# EAGLE design ESP-12 (EAGLE 7.3.0)
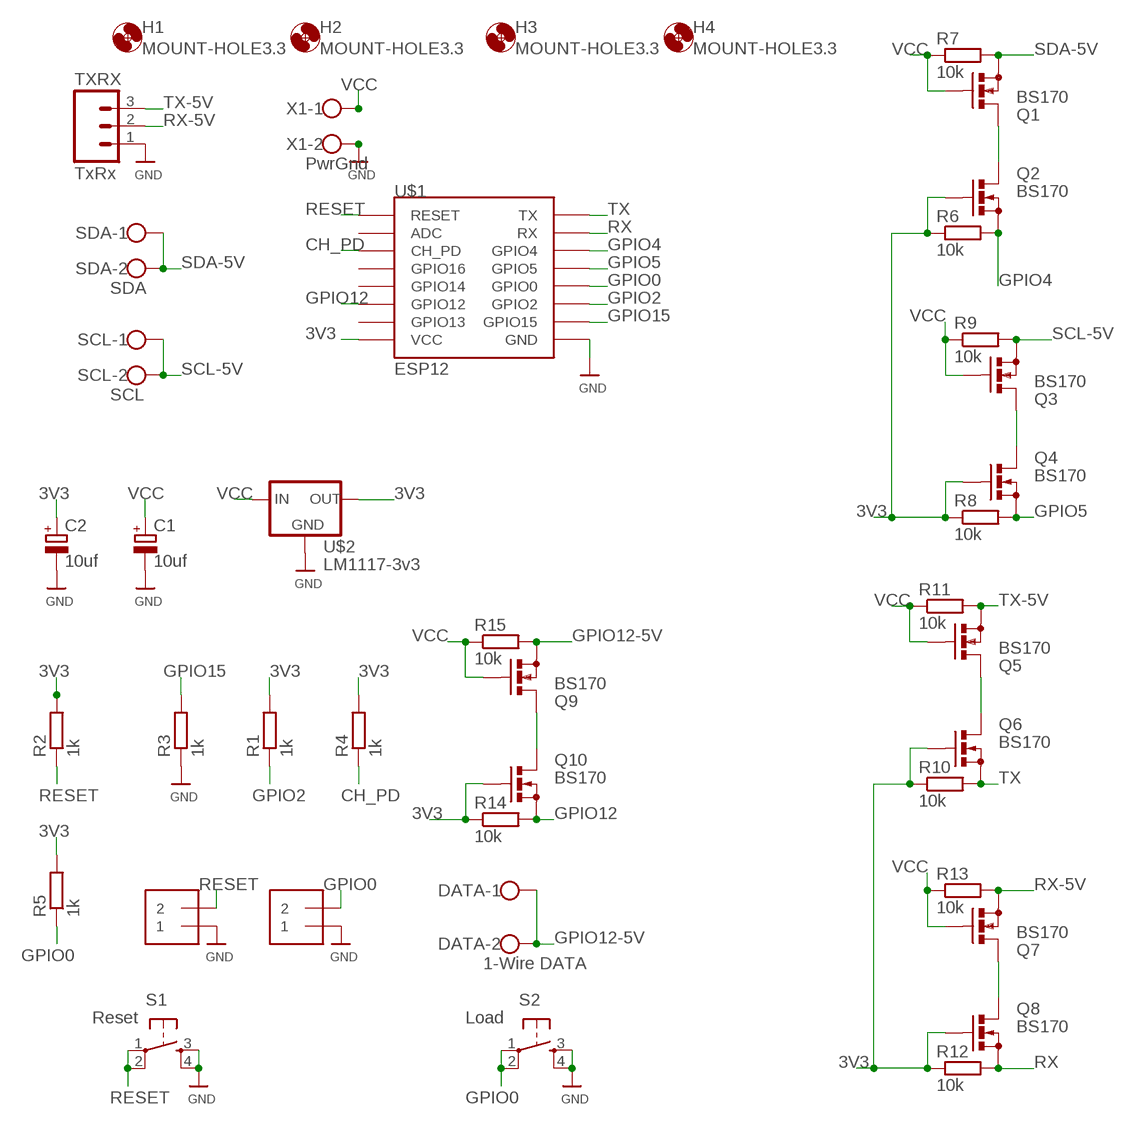
[diagram p0: schematic, sheet 1]

## Parts
C1  10uf  CPOL-EUE5-4  [E5-4]
C2  10uf  CPOL-EUE5-4  [E5-4]
DATA  1-Wire DATA  W237-102  [W237-102]
H1  MOUNT-HOLE3.3  [3,3]
H2  MOUNT-HOLE3.3  [3,3]
H3  MOUNT-HOLE3.3  [3,3]
H4  MOUNT-HOLE3.3  [3,3]
J1  1X2-3.5MM  [1X2-3.5MM]
J2  1X2-3.5MM  [1X2-3.5MM]
Q1  BS170  [SOT54E]
Q2  BS170  [SOT54E]
Q3  BS170  [SOT54E]
Q4  BS170  [SOT54E]
Q5  BS170  [SOT54E]
Q6  BS170  [SOT54E]
Q7  BS170  [SOT54E]
Q8  BS170  [SOT54E]
Q9  BS170  [SOT54E]
Q10  BS170  [SOT54E]
R1  1k  R-EU_0207/10  [0207/10]
R2  1k  R-EU_0207/10  [0207/10]
R3  1k  R-EU_0207/10  [0207/10]
R4  1k  R-EU_0207/10  [0207/10]
R5  1k  R-EU_0207/10  [0207/10]
R6  10k  R-EU_0207/10  [0207/10]
R7  10k  R-EU_0207/10  [0207/10]
R8  10k  R-EU_0207/10  [0207/10]
R9  10k  R-EU_0207/10  [0207/10]
R10  10k  R-EU_0207/10  [0207/10]
R11  10k  R-EU_0207/10  [0207/10]
R12  10k  R-EU_0207/10  [0207/10]
R13  10k  R-EU_0207/10  [0207/10]
R14  10k  R-EU_0207/10  [0207/10]
R15  10k  R-EU_0207/10  [0207/10]
S1  Reset  TAC_SWITCHPTH  [TACTILE-PTH]
S2  Load  TAC_SWITCHPTH  [TACTILE-PTH]
SCL  SCL  W237-102  [W237-102]
SDA  SDA  W237-102  [W237-102]
TXRX  TxRx  M03LONGPADS  [1X03_LONGPADS]
U$1  ESP12  [ESP12]
U$2  LM1117-3v3  V_REG_LD1117VXX  [78XXL]
X1  PwrGnd  W237-102  [W237-102]

## Nets
3V3 [3V3]: C2.+ Q2.G Q4.G Q6.G Q8.G Q10.G R1.2 R2.2 R4.2 R5.2 R6.1 R8.1 R10.1 R12.1 R14.1 U$1.VCC U$2.GND(OUT)
CH_PD: R4.1 U$1.CH_PD
GND [GND]: C1.- C2.- J1.1 J2.1 R3.1 S1.3 S1.4 S2.3 S2.4 TXRX.1 U$1.GND U$2.IN(GND) X1.2
GPIO0: J2.2 R5.1 S2.1 S2.2 U$1.GPIO0
GPIO2: R1.1 U$1.GPIO2
GPIO4: Q2.S R6.2 U$1.GPIO4
GPIO5: Q4.S R8.2 U$1.GPIO5
GPIO12: Q10.S R14.2 U$1.GPIO12
GPIO12-5V: DATA.1 DATA.2 Q9.S R15.2
GPIO15: R3.2 U$1.GPIO15
N$4: Q3.D Q4.D
N$8: Q1.D Q2.D
N$9: Q5.D Q6.D
N$10: Q7.D Q8.D
N$11: Q9.D Q10.D
RESET: J1.2 R2.1 S1.1 S1.2 U$1.RESET
RX: Q8.S R12.2 U$1.RX
RX-5V: Q7.S R13.2 TXRX.2
SCL-5V: Q3.S R9.2 SCL.1 SCL.2
SDA-5V: Q1.S R7.2 SDA.1 SDA.2
TX: Q6.S R10.2 U$1.TX
TX-5V: Q5.S R11.2 TXRX.3
VCC [VCC]: C1.+ Q1.G Q3.G Q5.G Q7.G Q9.G R7.1 R9.1 R11.1 R13.1 R15.1 U$2.OUT(IN) X1.1
Unconnected: U$1.ADC U$1.GPIO13 U$1.GPIO14 U$1.GPIO16

## Library data of the parts
C1 C2 = qfm-trx1-24g:CPOL-EU: POLARIZED CAPACITOR, European symbol
DATA SCL SDA X1 = con-wago-500:W237-102: WAGO SCREW CLAMP; MPN: 237-102; OC_FARNELL: unknown; OC_NEWARK: 70K9898
H1-H4 = holes:MOUNT-HOLE: MOUNTING HOLE with drill center marker
J1 J2 = Adafruit:1X2: 3.5mm Terminal block http://www.ladyada.net/library/pcb/eaglelibrary.html
Q1-Q10 = BS170-inline:BS170: N-CHANNEL MOS FET
R1-R15 = rcl:R-EU_: RESISTOR, European symbol
S1 S2 = SparkFun:TAC_SWITCH: Momentary Switch Button commonly used for reset or general input. Spark Fun Electronics SKU : COM-00097
TXRX = SparkFun-Connectors:M03: Header 3 Standard 3-pin 0.1" header. Use with straight break away headers (SKU : PRT-00116), right angle break away headers (PRT-00553), swiss pins (PRT-00743), machine pins (PRT-00117), and female headers (PRT-00115). Molex polarized connector foot print use with SKU : PRT-08232 with associated crimp pins and housings.
U$1 = esp8266modules:ESP12: ESP8266 Wifi module 12
U$2 = SparkFun-PowerIC:V_REG_LD1117VXX: LD1117VXX voltage regulator. We carry the 3.3V version (COM-00526) in TO-220 package.

## Net classes
1 VCC: width 0.508 mm
2 GND: width 0.508 mm
3 3V3: width 0.508 mm

## Board
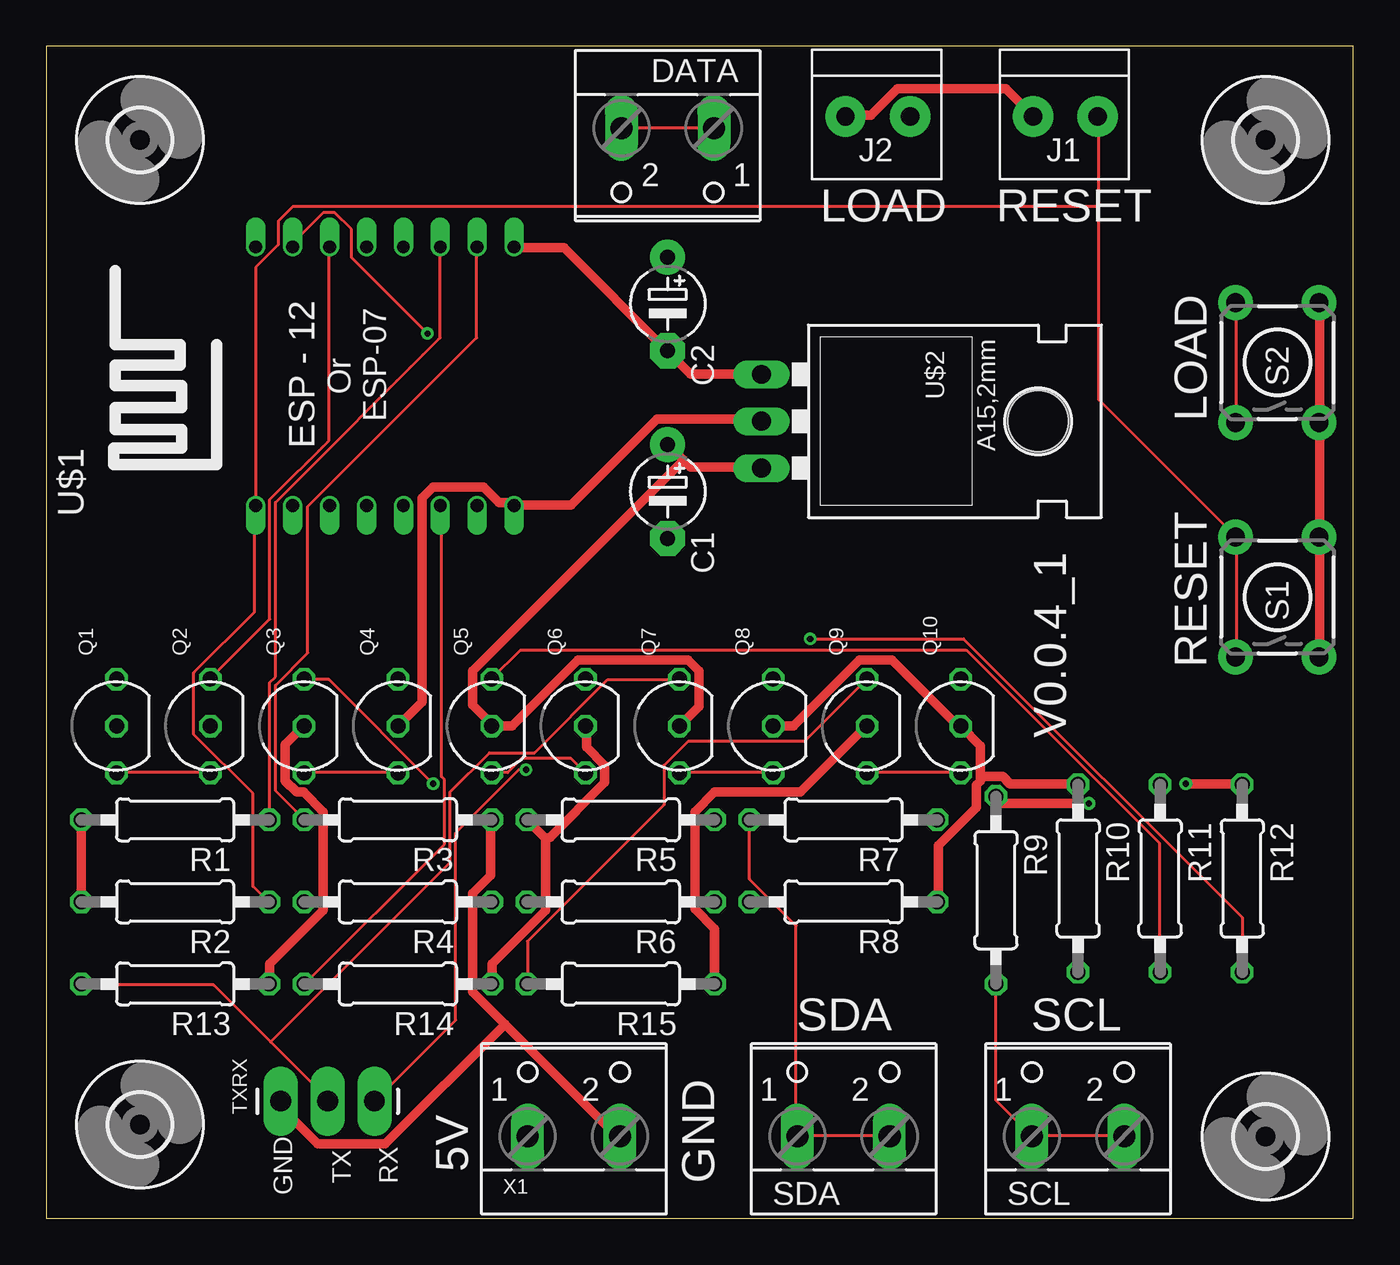
[diagram p1: board, top side]
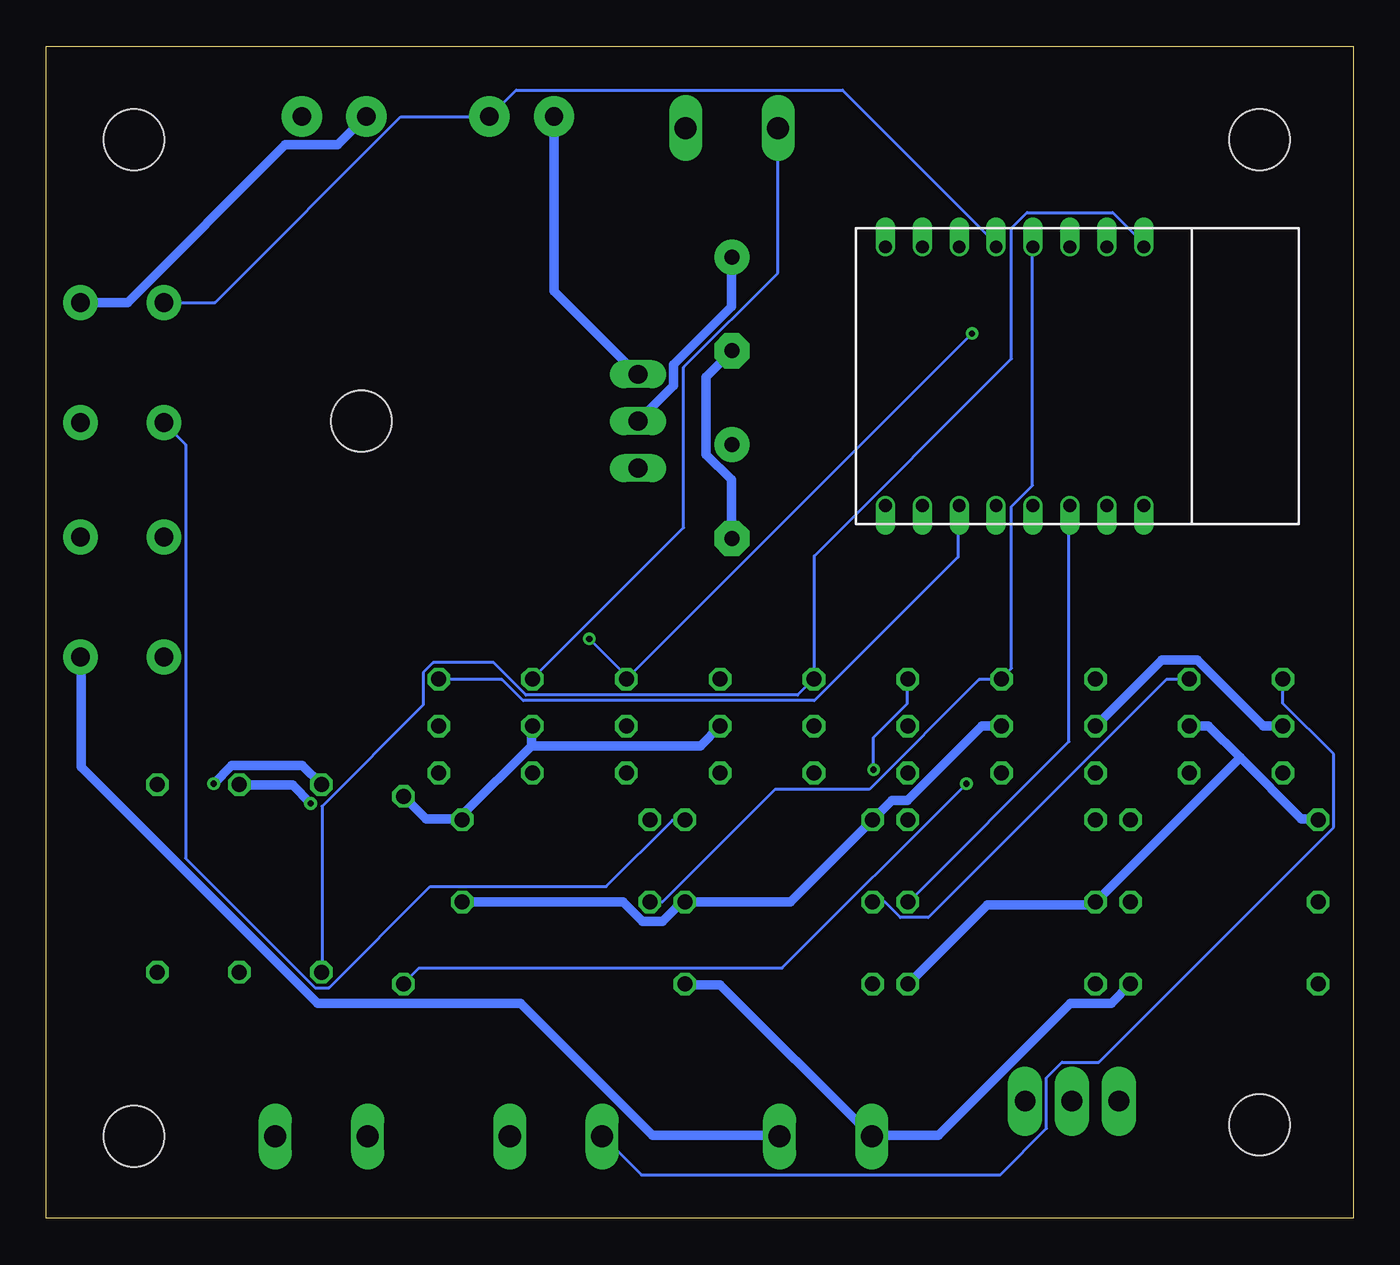
[diagram p2: board, bottom side, seen from below]

Size 70.79 x 63.49 mm. Coordinates in mm from the lower left corner, seen from the top.
Outline: 0,0 70.79,0 70.79,63.49 0,63.49 0,0
Copper layers (1*16): Top 0.0356mm / dielectric 1.5011mm / Bottom 0.0356mm
Design rules "OSHPark": minimum track width 6mil, minimum drill 13mil, track to track 6mil, track to pad 6mil, pad to pad 6mil, via to via 6mil, smd to smd 6mil, copper to edge 15mil, drill to drill 6mil, minimum pad ring 7mil, minimum via ring 7mil, stop-mask expansion 3mil, vias tented up to drill 0mil, thermal gap 10mil

### Footprints (pad centres in the part's own frame; a part is rotated, then mirrored left to right if it is on the bottom)
E5-4 = drill 0.813 pad 1.905: + -2.54,0 | drill 0.813 pad 1.905 octagon: - 2.54,0
W237-102 = drill 1.194 long: 1 -2.5,-1.27; 2 2.5,-1.27
3,3 = hole 3.3: 0,0
1X2-3.5MM = drill 1 pad 2.184: 1 1.8,0; 2 -1.7,0
SOT54E = drill 0.813 octagon: D -1.27,0; G 1.27,0; S 3.81,0
0207/10 = drill 0.813 octagon: 1 -5.08,0; 2 5.08,0
TACTILE-PTH = drill 1.016 pad 1.88: 1 -3.251,2.261; 2 3.251,2.261; 3 -3.251,-2.261; 4 3.251,-2.261
1X03_LONGPADS = drill 1.118 pad 1.88 long: 1 0,0; 2 2.54,0; 3 5.08,0
ESP12 = drill 0.7 offset: ADC -7.1,3.8; CH_PD -7.1,1.8; GND 6.9,-8.2; GPIO0 6.9,-2.2; GPIO2 6.9,-4.2; GPIO4 6.9,1.8; GPIO5 6.9,-0.2; GPIO12 -7.1,-4.2; GPIO13 -7.1,-6.2; GPIO14 -7.1,-2.2; GPIO15 6.9,-6.2; GPIO16 -7.1,-0.2; RESET -7.1,5.8; RX 6.9,3.8; TX 6.9,5.8; VCC -7.1,-8.2
78XXL = drill 1.016 long: GND 0,-3.81; IN -2.54,-3.81; OUT 2.54,-3.81 | hole 3.302: 0,11.176

### Placement (x,y rotation side)
C1  33.66,39.37 270 top
C2  33.66,49.53 270 top
DATA  33.66,57.78 180 top
H1  5.08,5.08 0 top
H2  66.04,4.45 0 top
H3  66.04,58.42 0 top
H4  5.08,58.42 0 top
J1  55.24,59.69 180 top
J2  45.09,59.69 180 top
Q1  3.81,25.4 90 top
Q2  8.89,25.4 90 top
Q3  13.97,25.4 90 top
Q4  19.05,25.4 90 top
Q5  24.13,25.4 90 top
Q6  29.21,25.4 90 top
Q7  34.29,25.4 90 top
Q8  39.37,25.4 90 top
Q9  44.45,25.4 90 top
Q10  49.53,25.4 90 top
R1  6.99,21.59 180 top
R2  6.99,17.14 180 top
R3  19.05,21.59 180 top
R4  19.05,17.14 180 top
R5  31.11,21.59 180 top
R6  31.11,17.14 180 top
R7  43.18,21.59 180 top
R8  43.18,17.14 180 top
R9  51.44,17.78 270 top
R10  55.88,18.41 270 top
R11  60.33,18.41 270 top
R12  64.77,18.41 270 top
R13  6.99,12.7 180 top
R14  19.05,12.7 180 top
R15  31.11,12.7 180 top
S1  66.67,33.66 90 top
S2  66.67,46.35 90 top
SCL  55.88,5.71 0 top
SDA  43.18,5.71 0 top
TXRX  12.7,6.35 0 top
U$1  17.14,45.72 90 top
U$2  42.55,43.18 270 top
X1  28.57,5.71 0 top

### Tracks (layer width: path | path; a pad name or v marks a point on that pad's centre or on a via)
3V3  (via drill 0.33)
  Top 0.508: 50.6,23.93 50.6,25.6 Q10.G 49.3,26.75 45.8,30.25 44.04,30.25 40.46,26.67 Q8.G | 50.6,23.93 50.6,23.7 50.37,23.47 50.37,22.25 48.31,20.19 48.31,17.14 R8.1 | 50.6,23.93 51.82,23.93 52.2,23.55 55.85,23.55 R10.1 | v61.72,23.55 64.77,23.55 R12.1 | U$2.GND 38.63,43.28 33.07,43.28 28.42,38.63 25.38,38.63 U$1.VCC 25.15,38.79 24.54,38.79 23.7,39.62 20.95,39.62 20.34,39.01 20.34,27.96 Q4.G | R1.2 R2.2 | 27.05,20.57 27.05,16.69 24.16,13.79 24.16,12.72 R14.1 | R5.2 27.05,20.57 | Q6.G 29.26,26.67 29.26,25.53 30.25,24.54 30.25,23.62 27.28,20.65 27.05,20.57
  Bottom 0.508: v61.72,23.55 60.73,24.54 56.92,24.54 R10.1 | U$2.GND 36.8,45.11 36.8,46.25 33.68,49.38 33.68,52.05 C2.+ | Q2.G 7.85,26.67 6.13,24.96 | 6.13,24.96 2.82,21.64 1.91,21.64 R1.2 | 6.13,24.96 13.95,17.14 R4.2 14.17,16.99 19.81,16.99 24.08,12.72 R14.1 | Q4.G 20.12,26.67 24.16,22.63 24.99,22.63 R5.2 30.48,17.14 R6.1 36.42,17.07 37.41,16.08 38.48,16.08 39.55,17.14 R8.1
CH_PD
  Bottom 0.152: U$1.CH_PD 15.39,38.56 15.39,25.83 24.08,17.14 R4.1
GND
  Top 0.508: 24.84,10.52 30.86,4.5 31.01,4.5 X1.2 | 24.84,10.52 23.09,12.27 23.09,17.6 24.08,18.59 24.08,21.57 R3.1 | 24.84,10.52 18.36,4.04 14.71,4.04 12.72,6.02 12.72,6.33 TXRX.1 | S1.3 68.96,30.4 68.96,36.88 S1.4 68.96,37.11 68.96,43.05 S2.3 68.96,43.36 68.96,49.61 S2.4 | J2.1 43.36,59.74 44.65,59.74 46.1,61.19 51.97,61.19 53.42,59.74 J1.1 | U$1.GND 25.38,52.58 28.04,52.58 33.6,47.02 C2.- 33.83,46.79 34.9,45.72 U$2.IN
  Bottom 0.508: C1.- 33.68,36.88 33.68,40.01 35.05,41.38 35.05,45.57 33.68,46.94 C2.- | J2.1 43.28,59.66 43.28,50.22 38.79,45.72 U$2.IN | S2.4 66.37,49.61 57.84,58.14 55.02,58.14 53.49,59.66 J1.1 | X1.2 31.09,4.5 37.95,4.5 45.11,11.66 56.08,11.66 68.89,24.46 68.89,30.4 S1.3
GPIO0
  Top 0.152: S2.2 64.47,49.61 64.47,43.13 S2.1
  Bottom 0.152: U$1.GPIO0 19.36,52.65 19.36,52.81 27.66,61.11 45.34,61.11 46.71,59.74 J2.2 46.79,59.66 51.59,59.66 61.65,49.61 S2.2 | R5.1 36.2,21.57 36.88,21.57 40.46,17.98 49.99,17.98 55.47,12.5 56.24,12.5 63.25,19.51 63.25,41.91 64.39,43.05 S2.1
GPIO2
  Top 0.152: U$1.GPIO2 21.34,52.58 21.34,47.7 12.42,38.79 12.42,29.34 12.12,29.03 12.12,21.64 R1.1
GPIO4
  Top 0.152: U$1.GPIO4 15.32,52.58 15.32,42.14 12.12,38.94 12.12,32.46 8.91,29.26 Q2.S
  Bottom 0.152: R6.2 25.38,17.14 24.54,16.31 23.01,16.31 10.13,29.18 8.91,29.18 Q2.S
GPIO5
  Bottom 0.152: U$1.GPIO5 17.37,52.58 17.37,39.7 18.52,38.56 18.52,29.79 19.05,29.26 Q4.S 19.05,29.18 20.27,29.18 26.21,23.24 31.32,23.24 37.41,17.14 R8.2
GPIO12
  Top 0.152: U$1.GPIO12 21.41,38.56 21.41,23.93 21.57,23.77 21.57,20.27 14.02,12.72 R14.2
  Bottom 0.152: Q10.S 49.53,29.18 46.1,29.18 44.96,28.04 29.18,28.04 21.41,35.81 21.41,38.56 U$1.GPIO12
GPIO12-5V
  Top 0.152: DATA.1 DATA.2 | Q9.S 41.07,25.83 34.75,25.83 33.45,24.54 33.45,22.4 26.06,15.01 26.06,12.72 R15.2
  Bottom 0.152: DATA.2 31.17,51.21 36.27,46.1 36.27,37.41 44.42,29.26 Q9.S
GPIO15
  Top 0.152: U$1.GPIO15 23.32,52.58 23.32,47.7 14.17,38.56 14.17,30.63 12.42,28.88 12.42,23.16 13.95,21.64 R3.2
N$4
  Top 0.152: Q3.D 14.02,24.16 19.05,24.16 Q4.D
N$8
  Top 0.152: Q1.D 3.81,24.16 8.84,24.16 Q2.D
N$9
  Top 0.152: Q6.D 28.42,24.92 25.76,24.92 24.99,24.16 24.16,24.16 Q5.D
N$10
  Top 0.152: Q7.D 34.29,24.16 39.32,24.16 Q8.D
N$11
  Top 0.152: Q9.D 44.5,24.16 49.53,24.16 Q10.D
RESET
  Top 0.152: R2.1 12.04,17.14 11.2,17.98 11.2,23.01 8,26.21 8,29.57 11.28,32.84 11.28,38.56 U$1.RESET 11.35,38.63 11.35,51.51 12.57,52.73 12.57,54.03 13.34,54.79 57,54.79 | S1.1 64.47,30.4 64.47,36.88 S1.2 64.39,36.96 57,44.35 57,54.79 | 57,54.79 57,59.66 J1.2
RX  (via drill 0.33)
  Top 0.152: v20.65,47.93 16.54,52.05 16.54,53.57 15.62,54.48 15.01,54.48 13.41,52.88 13.41,52.65 U$1.RX | R12.2 64.77,16.31 49.68,31.39 v41.38,31.39
  Bottom 0.152: v20.65,47.93 Q8.S 39.32,29.34 v41.38,31.39
RX-5V
  Top 0.152: 12.15,9.56 15.24,6.48 TXRX.2 | 12.15,9.56 9.07,12.65 1.91,12.65 R13.2 | 12.15,9.56 21.87,19.28 21.87,23.09 24,25.22 26.44,25.22 30.4,29.18 34.29,29.18 Q7.S
SCL-5V  (via drill 0.33)
  Top 0.152: R9.2 51.44,6.4 53.34,4.5 SCL.1 53.42,4.5 58.37,4.5 SCL.2 | v20.95,23.55 15.32,29.18 14.02,29.18 Q3.S
  Bottom 0.152: v20.95,23.55 30.94,13.56 50.6,13.56 51.44,12.72 R9.2
SDA-5V
  Top 0.152: R7.2 38.1,18.36 40.62,15.85 40.62,4.5 SDA.1 40.69,4.5 45.64,4.5 SDA.2
  Bottom 0.152: Q1.S 3.81,27.89 1.07,25.15 1.07,21.18 13.79,8.46 15.77,8.46 16.61,7.62 16.61,4.88 19.13,2.36 38.56,2.36 40.62,4.42 SDA.1
TX
  Bottom 0.152: U$1.TX 11.35,52.65 11.35,52.81 13.03,54.48 17.68,54.48 18.52,53.65 18.52,46.56 29.18,35.89 29.18,29.26 Q6.S 29.26,29.18 30.1,28.35 44.81,28.35 46.56,30.1 49.84,30.1 50.37,29.57 50.37,27.81 55.85,22.33 55.85,13.34 R10.2
TX-5V  (via drill 0.33)
  Top 0.152: v25.98,24.31 25.6,24.31 22.17,20.88 22.17,10.74 TXRX.3 | R11.2 60.27,13.34 60.27,20.34 49.84,30.79 25.68,30.79 24.16,29.26 Q5.S
  Bottom 0.152: v25.98,24.31 25.98,26.06 24.16,27.89 24.16,29.18 Q5.S
VCC  (via drill 0.33)
  Top 0.508: R13.1 12.12,12.72 12.12,13.79 15.01,16.69 15.01,22.02 13.95,23.09 13.56,23.09 12.95,23.7 12.95,25.68 13.95,26.67 Q3.G | v56.46,22.48 51.82,22.48 R9.1 | 34.52,41.07 33.68,41.91 C1.+ | 34.52,41.07 34.9,40.69 38.71,40.69 U$2.OUT | Q7.G 35.36,27.74 35.36,29.64 34.75,30.25 28.8,30.25 25.22,26.67 Q5.G 24,26.9 23.09,27.81 23.09,29.64 34.52,41.07 | R15.1 36.2,15.7 35.13,16.76 35.13,22.02 36.2,23.09 40.84,23.09 44.42,26.67 Q9.G
  Bottom 0.508: R15.1 36.2,12.65 34.29,12.65 26.14,4.5 X1.1 25.83,4.5 22.48,4.5 15.32,11.66 13.11,11.66 R13.1 | Q1.G 4.88,26.67 8.46,30.25 10.36,30.25 13.95,26.67 Q3.G | R9.1 50.22,21.64 48.31,21.64 R7.1 48.23,21.87 44.5,25.6 | v56.46,22.48 57.45,23.47 60.27,23.47 R11.1 | 44.5,25.6 44.5,26.67 Q9.G | 44.5,25.6 35.36,25.6 Q7.G

### Text on the board
tNames: LOAD | RESET | Or / ESP-07 | LOAD | RESET | V0.0.4_1 | SDA | SCL | 5V | TX | RX | GND | GND